# EAGLE schematic switch_board (EAGLE 8.1.1)
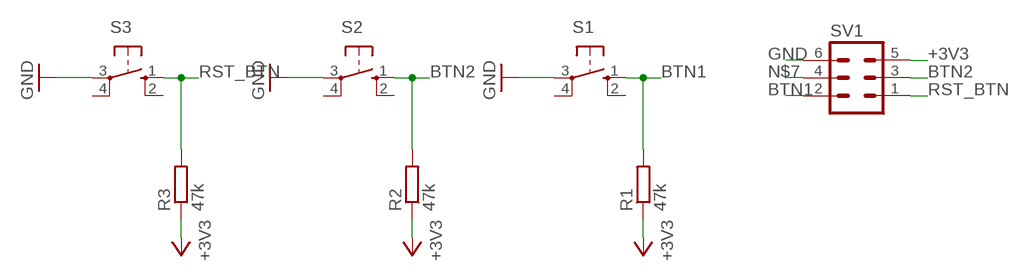
[diagram p0: schematic, sheet 1]

## Parts
R1  47k  R-EU_0207/10  [0207/10]
R2  47k  R-EU_0207/10  [0207/10]
R3  47k  R-EU_0207/10  [0207/10]
S1  10-XX  [B3F-10XX]
S2  10-XX  [B3F-10XX]
S3  10-XX  [B3F-10XX]
SV1  ML6  [ML6]

## Nets
+3V3: R1.1 R2.1 R3.1 SV1.5
BTN1: R1.2 S1.1(S) SV1.2
BTN2: R2.2 S2.1(S) SV1.3
GND: S1.3(P) S2.3(P) S3.3(P) SV1.6
N$7: SV1.4
RST_BTN: R3.2 S3.1(S) SV1.1
Unconnected: S1.2(S1) S1.4(P1) S2.2(S1) S2.4(P1) S3.2(S1) S3.4(P1)

## Library data of the parts
R1-R3 = rcl:R-EU_: RESISTOR, European symbol
S1-S3 = switch-omron:10-XX: OMRON SWITCH; MPN: B3F-1000; OC_FARNELL: 176432; OC_NEWARK: 36M3542
SV1 = con-harting-ml:ML6: HARTING; OC_FARNELL: unknown; OC_NEWARK: unknown